# Altium schematic sheet 17_FE_PORT_17-24.SchDoc
size 594 x 420 mm; Author: Serbinov O.A.; CompanyName: ELSICOM; DrawnBy: Serbinov O.A.; Engineer: Serbinov O.A.; Organization: Elsicom; Address1: Kirova avenue, 58; Address2: Tomsk; Address3: Russia 634012; DocumentNumber: 18; SheetNumber: 18; SheetTotal: 44; ProjectName: 48_PORTS
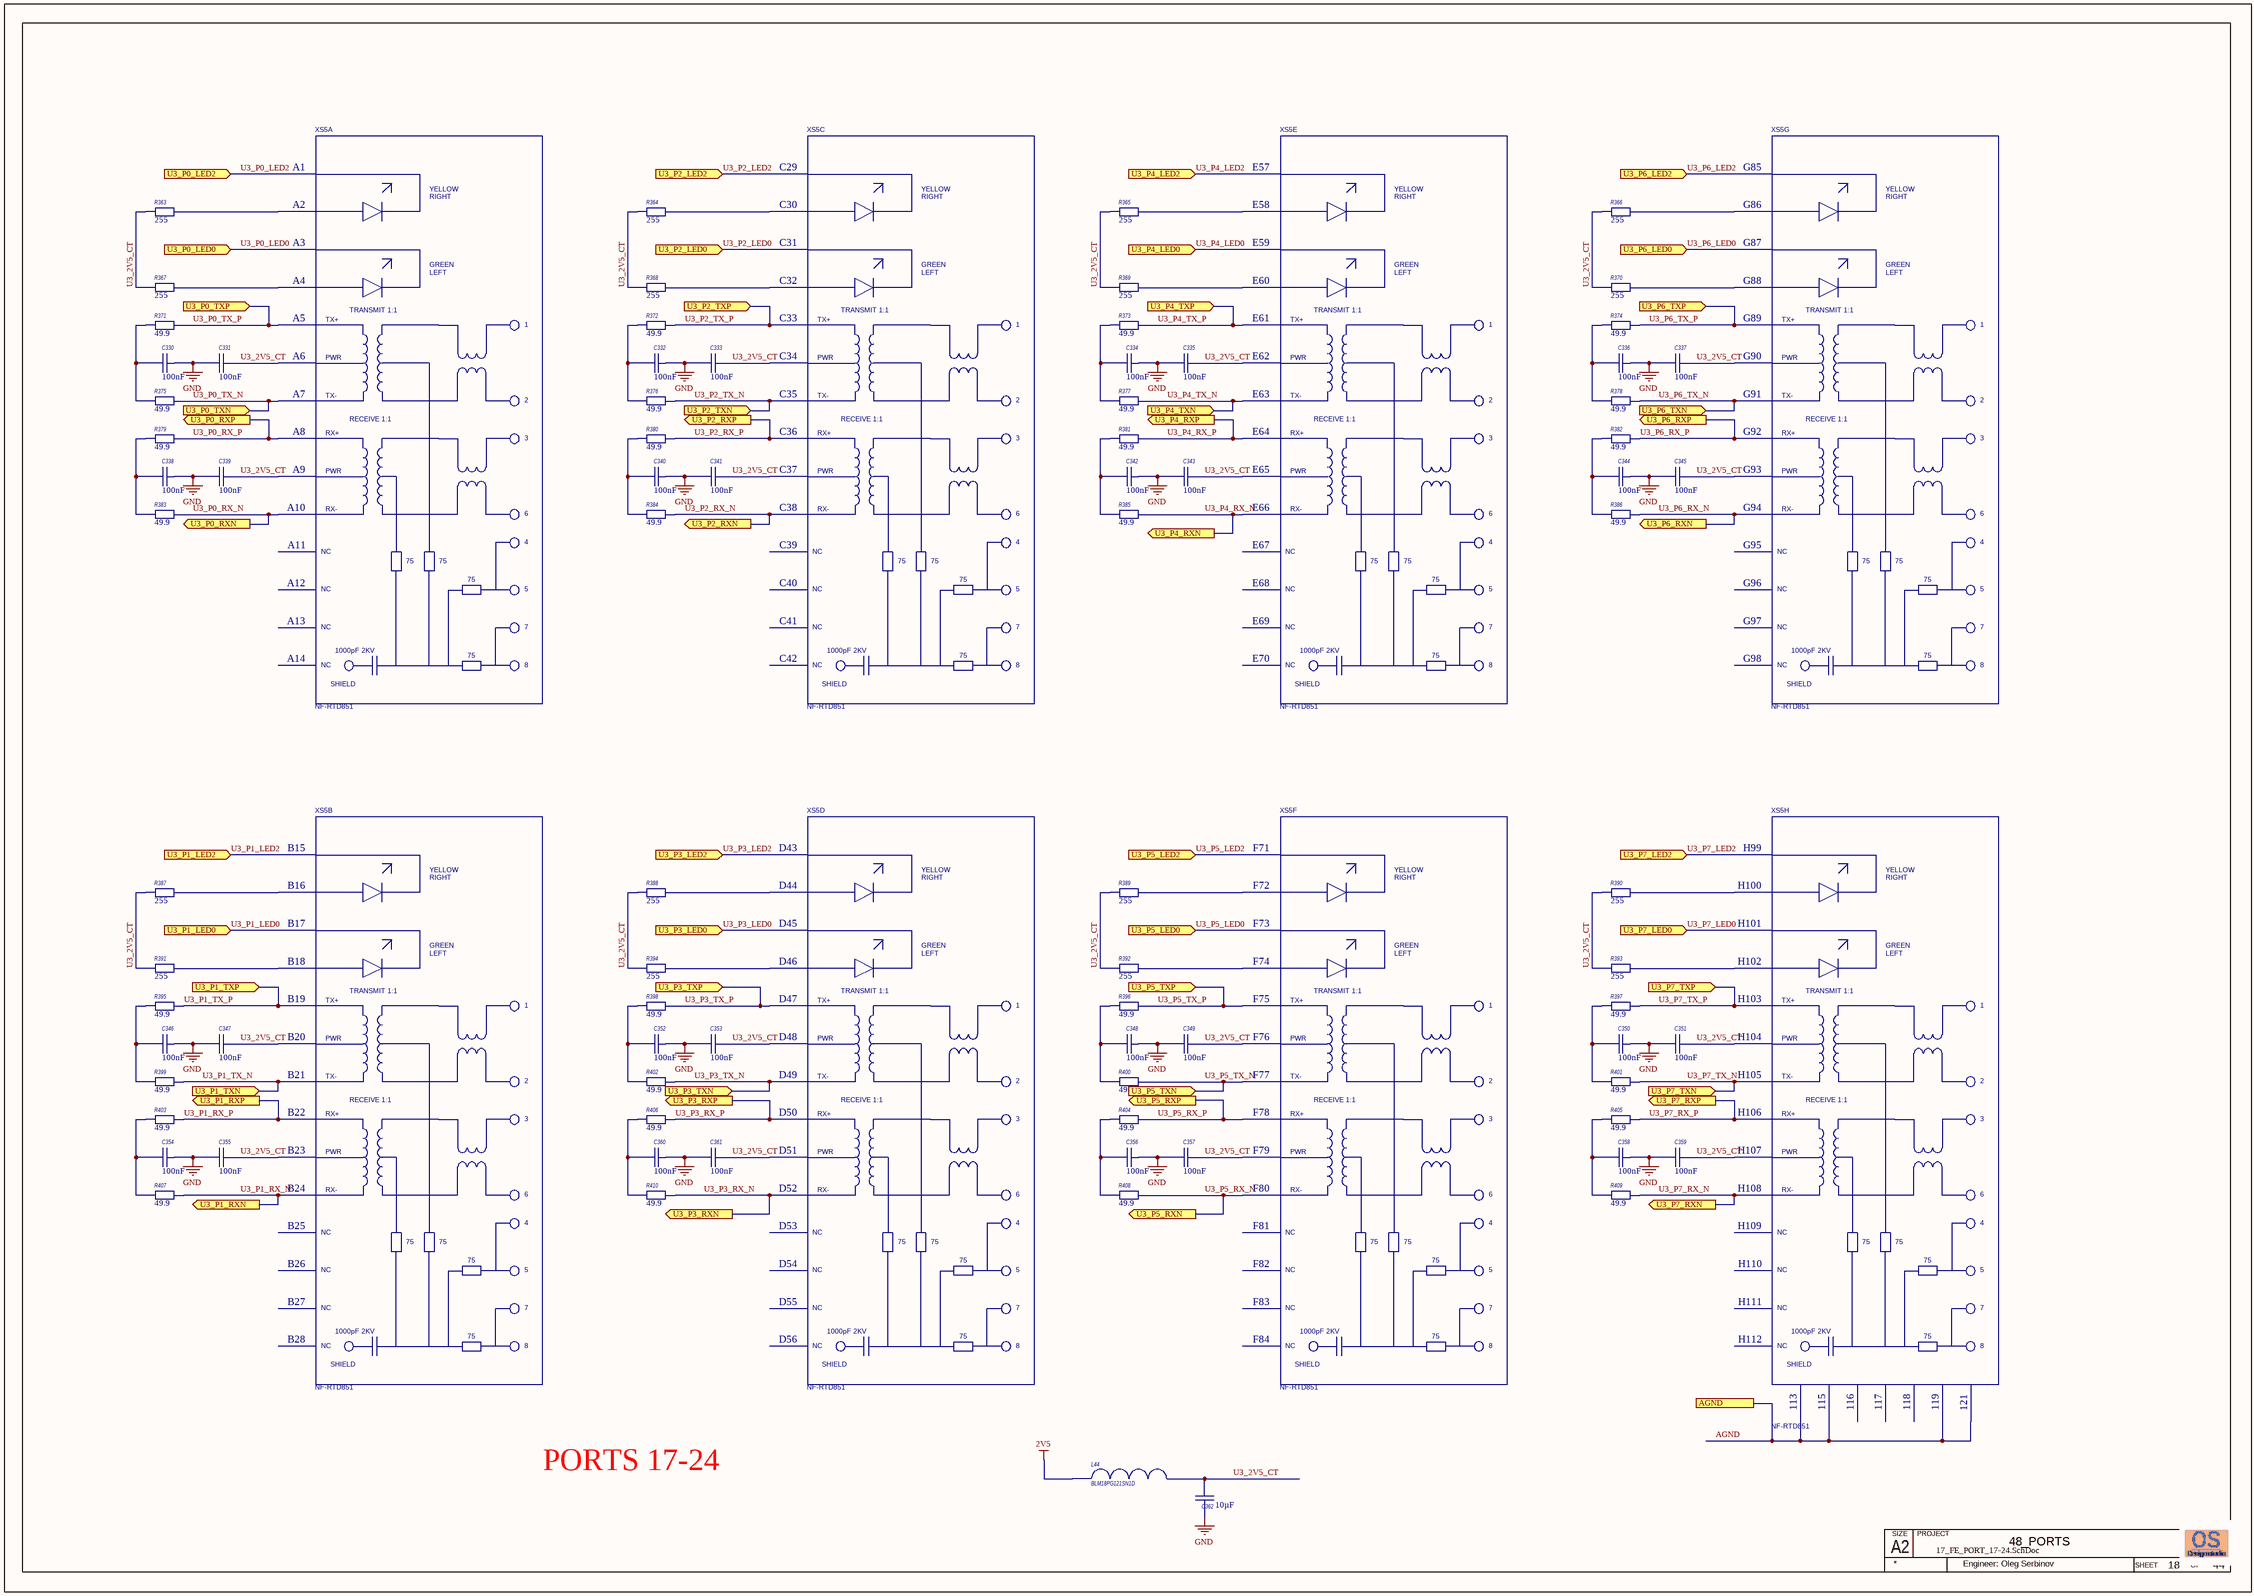
[diagram p0: 17_FE_PORT_17-24.SchDoc]

## Parts
C330  Capacitance: 100nF  [C0402_IPC High Density]  (hidden comment: GRM155R71E104KE14D)
C331  Capacitance: 100nF  [C0402_IPC High Density]  (hidden comment: GRM155R71E104KE14D)
C332  Capacitance: 100nF  [C0402_IPC High Density]  (hidden comment: GRM155R71E104KE14D)
C333  Capacitance: 100nF  [C0402_IPC High Density]  (hidden comment: GRM155R71E104KE14D)
C334  Capacitance: 100nF  [C0402_IPC High Density]  (hidden comment: GRM155R71E104KE14D)
C335  Capacitance: 100nF  [C0402_IPC High Density]  (hidden comment: GRM155R71E104KE14D)
C336  Capacitance: 100nF  [C0402_IPC High Density]  (hidden comment: GRM155R71E104KE14D)
C337  Capacitance: 100nF  [C0402_IPC High Density]  (hidden comment: GRM155R71E104KE14D)
C338  Capacitance: 100nF  [C0402_IPC High Density]  (hidden comment: GRM155R71E104KE14D)
C339  Capacitance: 100nF  [C0402_IPC High Density]  (hidden comment: GRM155R71E104KE14D)
C340  Capacitance: 100nF  [C0402_IPC High Density]  (hidden comment: GRM155R71E104KE14D)
C341  Capacitance: 100nF  [C0402_IPC High Density]  (hidden comment: GRM155R71E104KE14D)
C342  Capacitance: 100nF  [C0402_IPC High Density]  (hidden comment: GRM155R71E104KE14D)
C343  Capacitance: 100nF  [C0402_IPC High Density]  (hidden comment: GRM155R71E104KE14D)
C344  Capacitance: 100nF  [C0402_IPC High Density]  (hidden comment: GRM155R71E104KE14D)
C345  Capacitance: 100nF  [C0402_IPC High Density]  (hidden comment: GRM155R71E104KE14D)
C346  Capacitance: 100nF  [C0402_IPC High Density]  (hidden comment: GRM155R71E104KE14D)
C347  Capacitance: 100nF  [C0402_IPC High Density]  (hidden comment: GRM155R71E104KE14D)
C348  Capacitance: 100nF  [C0402_IPC High Density]  (hidden comment: GRM155R71E104KE14D)
C349  Capacitance: 100nF  [C0402_IPC High Density]  (hidden comment: GRM155R71E104KE14D)
C350  Capacitance: 100nF  [C0402_IPC High Density]  (hidden comment: GRM155R71E104KE14D)
C351  Capacitance: 100nF  [C0402_IPC High Density]  (hidden comment: GRM155R71E104KE14D)
C352  Capacitance: 100nF  [C0402_IPC High Density]  (hidden comment: GRM155R71E104KE14D)
C353  Capacitance: 100nF  [C0402_IPC High Density]  (hidden comment: GRM155R71E104KE14D)
C354  Capacitance: 100nF  [C0402_IPC High Density]  (hidden comment: GRM155R71E104KE14D)
C355  Capacitance: 100nF  [C0402_IPC High Density]  (hidden comment: GRM155R71E104KE14D)
C356  Capacitance: 100nF  [C0402_IPC High Density]  (hidden comment: GRM155R71E104KE14D)
C357  Capacitance: 100nF  [C0402_IPC High Density]  (hidden comment: GRM155R71E104KE14D)
C358  Capacitance: 100nF  [C0402_IPC High Density]  (hidden comment: GRM155R71E104KE14D)
C359  Capacitance: 100nF  [C0402_IPC High Density]  (hidden comment: GRM155R71E104KE14D)
C360  Capacitance: 100nF  [C0402_IPC High Density]  (hidden comment: GRM155R71E104KE14D)
C361  Capacitance: 100nF  [C0402_IPC High Density]  (hidden comment: GRM155R71E104KE14D)
C362  Capacitance: 10µF  [CAPC2012[0805]]  (hidden comment: GRM21BR61C106KE15)
L44  BLM18PG121SN1D  [INDC1608X95N]
R363  Resistance (Ohms): 255  [RESC1005[0402]]  (hidden comment: ERJ-2RKF2550X)
R364  Resistance (Ohms): 255  [RESC1005[0402]]  (hidden comment: ERJ-2RKF2550X)
R365  Resistance (Ohms): 255  [RESC1005[0402]]  (hidden comment: ERJ-2RKF2550X)
R366  Resistance (Ohms): 255  [RESC1005[0402]]  (hidden comment: ERJ-2RKF2550X)
R367  Resistance (Ohms): 255  [RESC1005[0402]]  (hidden comment: ERJ-2RKF2550X)
R368  Resistance (Ohms): 255  [RESC1005[0402]]  (hidden comment: ERJ-2RKF2550X)
R369  Resistance (Ohms): 255  [RESC1005[0402]]  (hidden comment: ERJ-2RKF2550X)
R370  Resistance (Ohms): 255  [RESC1005[0402]]  (hidden comment: ERJ-2RKF2550X)
R371  Resistance: 49.9  [R0402_IPC High Density]  (hidden comment: ERJ-2RKF49R9X)
R372  Resistance: 49.9  [R0402_IPC High Density]  (hidden comment: ERJ-2RKF49R9X)
R373  Resistance: 49.9  [R0402_IPC High Density]  (hidden comment: ERJ-2RKF49R9X)
R374  Resistance: 49.9  [R0402_IPC High Density]  (hidden comment: ERJ-2RKF49R9X)
R375  Resistance: 49.9  [R0402_IPC High Density]  (hidden comment: ERJ-2RKF49R9X)
R376  Resistance: 49.9  [R0402_IPC High Density]  (hidden comment: ERJ-2RKF49R9X)
R377  Resistance: 49.9  [R0402_IPC High Density]  (hidden comment: ERJ-2RKF49R9X)
R378  Resistance: 49.9  [R0402_IPC High Density]  (hidden comment: ERJ-2RKF49R9X)
R379  Resistance: 49.9  [R0402_IPC High Density]  (hidden comment: ERJ-2RKF49R9X)
R380  Resistance: 49.9  [R0402_IPC High Density]  (hidden comment: ERJ-2RKF49R9X)
R381  Resistance: 49.9  [R0402_IPC High Density]  (hidden comment: ERJ-2RKF49R9X)
R382  Resistance: 49.9  [R0402_IPC High Density]  (hidden comment: ERJ-2RKF49R9X)
R383  Resistance: 49.9  [R0402_IPC High Density]  (hidden comment: ERJ-2RKF49R9X)
R384  Resistance: 49.9  [R0402_IPC High Density]  (hidden comment: ERJ-2RKF49R9X)
R385  Resistance: 49.9  [R0402_IPC High Density]  (hidden comment: ERJ-2RKF49R9X)
R386  Resistance: 49.9  [R0402_IPC High Density]  (hidden comment: ERJ-2RKF49R9X)
R387  Resistance (Ohms): 255  [RESC1005[0402]]  (hidden comment: ERJ-2RKF2550X)
R388  Resistance (Ohms): 255  [RESC1005[0402]]  (hidden comment: ERJ-2RKF2550X)
R389  Resistance (Ohms): 255  [RESC1005[0402]]  (hidden comment: ERJ-2RKF2550X)
R390  Resistance (Ohms): 255  [RESC1005[0402]]  (hidden comment: ERJ-2RKF2550X)
R391  Resistance (Ohms): 255  [RESC1005[0402]]  (hidden comment: ERJ-2RKF2550X)
R392  Resistance (Ohms): 255  [RESC1005[0402]]  (hidden comment: ERJ-2RKF2550X)
R393  Resistance (Ohms): 255  [RESC1005[0402]]  (hidden comment: ERJ-2RKF2550X)
R394  Resistance (Ohms): 255  [RESC1005[0402]]  (hidden comment: ERJ-2RKF2550X)
R395  Resistance: 49.9  [R0402_IPC High Density]  (hidden comment: ERJ-2RKF49R9X)
R396  Resistance: 49.9  [R0402_IPC High Density]  (hidden comment: ERJ-2RKF49R9X)
R397  Resistance: 49.9  [R0402_IPC High Density]  (hidden comment: ERJ-2RKF49R9X)
R398  Resistance: 49.9  [R0402_IPC High Density]  (hidden comment: ERJ-2RKF49R9X)
R399  Resistance: 49.9  [R0402_IPC High Density]  (hidden comment: ERJ-2RKF49R9X)
R400  Resistance: 49.9  [R0402_IPC High Density]  (hidden comment: ERJ-2RKF49R9X)
R401  Resistance: 49.9  [R0402_IPC High Density]  (hidden comment: ERJ-2RKF49R9X)
R402  Resistance: 49.9  [R0402_IPC High Density]  (hidden comment: ERJ-2RKF49R9X)
R403  Resistance: 49.9  [R0402_IPC High Density]  (hidden comment: ERJ-2RKF49R9X)
R404  Resistance: 49.9  [R0402_IPC High Density]  (hidden comment: ERJ-2RKF49R9X)
R405  Resistance: 49.9  [R0402_IPC High Density]  (hidden comment: ERJ-2RKF49R9X)
R406  Resistance: 49.9  [R0402_IPC High Density]  (hidden comment: ERJ-2RKF49R9X)
R407  Resistance: 49.9  [R0402_IPC High Density]  (hidden comment: ERJ-2RKF49R9X)
R408  Resistance: 49.9  [R0402_IPC High Density]  (hidden comment: ERJ-2RKF49R9X)
R409  Resistance: 49.9  [R0402_IPC High Density]  (hidden comment: ERJ-2RKF49R9X)
R410  Resistance: 49.9  [R0402_IPC High Density]  (hidden comment: ERJ-2RKF49R9X)
XS5  NF-RTD851  [NF-RTD851_2X4_LED_NF-RTD851_2X4_LED(Primary)]  (parts A,B,C,D,E,F,G,H of 8)

## Ports
AGND, U3_P0_LED0 (in), U3_P0_LED2 (in), U3_P0_RXN (out), U3_P0_RXP (out), U3_P0_TXN (in), U3_P0_TXP (in), U3_P1_LED0 (in), U3_P1_LED2 (in), U3_P1_RXN (out), U3_P1_RXP (out), U3_P1_TXN (in), U3_P1_TXP (in), U3_P2_LED0 (in), U3_P2_LED2 (in), U3_P2_RXN (out), U3_P2_RXP (out), U3_P2_TXN (in), U3_P2_TXP (in), U3_P3_LED0 (in), U3_P3_LED2 (in), U3_P3_RXN (out), U3_P3_RXP (out), U3_P3_TXN (in), U3_P3_TXP (in), U3_P4_LED0 (in), U3_P4_LED2 (in), U3_P4_RXN (out), U3_P4_RXP (out), U3_P4_TXN (in), U3_P4_TXP (in), U3_P5_LED0 (in), U3_P5_LED2 (in), U3_P5_RXN (out), U3_P5_RXP (out), U3_P5_TXN (in), U3_P5_TXP (in), U3_P6_LED0 (in), U3_P6_LED2 (in), U3_P6_RXN (out), U3_P6_RXP (out), U3_P6_TXN (in), U3_P6_TXP (in), U3_P7_LED0 (in), U3_P7_LED2 (in), U3_P7_RXN (out), U3_P7_RXP (out), U3_P7_TXN (in), U3_P7_TXP (in)

## Nets
2V5: L44.1
GND: C330.2 C331.1 C332.2 C333.1 C334.2 C335.1 C336.2 C337.1 C338.2 C339.1 C340.2 C341.1 C342.2 C343.1 C344.2 C345.1 C346.2 C347.1 C348.2 C349.1 C350.2 C351.1 C352.2 C353.1 C354.2 C355.1 C356.2 C357.1 C358.2 C359.1 C360.2 C361.1 C362.1
AGND: XS5.113 XS5.115 XS5.119 XS5.121 ; port AGND
U3_2V5_CT: C331.2 C333.2 C335.2 C337.2 C339.2 C341.2 C343.2 C345.2 C347.2 C349.2 C351.2 C353.2 C355.2 C357.2 C359.2 C361.2 C362.2 L44.2 R363.1 R364.1 R365.1 R366.1 R367.1 R368.1 R369.1 R370.1 R387.1 R388.1 R389.1 R390.1 R391.1 R392.1 R393.1 R394.1 XS5.A6 XS5.A9 XS5.B20 XS5.B23 XS5.C34 XS5.C37 XS5.D48 XS5.D51 XS5.E62 XS5.E65 XS5.F76 XS5.F79 XS5.G90 XS5.G93 XS5.H104 XS5.H107
U3_P0_LED0: XS5.A3 ; port U3_P0_LED0
U3_P0_LED2: XS5.A1 ; port U3_P0_LED2
U3_P0_RX_N: R383.2 XS5.A10 ; port U3_P0_RXN
U3_P0_RX_P: R379.2 XS5.A8 ; port U3_P0_RXP
U3_P0_TX_N: R375.2 XS5.A7 ; port U3_P0_TXN
U3_P0_TX_P: R371.2 XS5.A5 ; port U3_P0_TXP
U3_P1_LED0: XS5.B17 ; port U3_P1_LED0
U3_P1_LED2: XS5.B15 ; port U3_P1_LED2
U3_P1_RX_N: R407.2 XS5.B24 ; port U3_P1_RXN
U3_P1_RX_P: R403.2 XS5.B22 ; port U3_P1_RXP
U3_P1_TX_N: R399.2 XS5.B21 ; port U3_P1_TXN
U3_P1_TX_P: R395.2 XS5.B19 ; port U3_P1_TXP
U3_P2_LED0: XS5.C31 ; port U3_P2_LED0
U3_P2_LED2: XS5.C29 ; port U3_P2_LED2
U3_P2_RX_N: R384.2 XS5.C38 ; port U3_P2_RXN
U3_P2_RX_P: R380.2 XS5.C36 ; port U3_P2_RXP
U3_P2_TX_N: R376.2 XS5.C35 ; port U3_P2_TXN
U3_P2_TX_P: R372.2 XS5.C33 ; port U3_P2_TXP
U3_P3_LED0: XS5.D45 ; port U3_P3_LED0
U3_P3_LED2: XS5.D43 ; port U3_P3_LED2
U3_P3_RX_N: R410.2 XS5.D52 ; port U3_P3_RXN
U3_P3_RX_P: R406.2 XS5.D50 ; port U3_P3_RXP
U3_P3_TX_N: R402.2 XS5.D49 ; port U3_P3_TXN
U3_P3_TX_P: R398.2 XS5.D47 ; port U3_P3_TXP
U3_P4_LED0: XS5.E59 ; port U3_P4_LED0
U3_P4_LED2: XS5.E57 ; port U3_P4_LED2
U3_P4_RX_N: R385.2 XS5.E66 ; port U3_P4_RXN
U3_P4_RX_P: R381.2 XS5.E64 ; port U3_P4_RXP
U3_P4_TX_N: R377.2 XS5.E63 ; port U3_P4_TXN
U3_P4_TX_P: R373.2 XS5.E61 ; port U3_P4_TXP
U3_P5_LED0: XS5.F73 ; port U3_P5_LED0
U3_P5_LED2: XS5.F71 ; port U3_P5_LED2
U3_P5_RX_N: R408.2 XS5.F80 ; port U3_P5_RXN
U3_P5_RX_P: R404.2 XS5.F78 ; port U3_P5_RXP
U3_P5_TX_N: R400.2 XS5.F77 ; port U3_P5_TXN
U3_P5_TX_P: R396.2 XS5.F75 ; port U3_P5_TXP
U3_P6_LED0: XS5.G87 ; port U3_P6_LED0
U3_P6_LED2: XS5.G85 ; port U3_P6_LED2
U3_P6_RX_N: R386.2 XS5.G94 ; port U3_P6_RXN
U3_P6_RX_P: R382.2 XS5.G92 ; port U3_P6_RXP
U3_P6_TX_N: R378.2 XS5.G91 ; port U3_P6_TXN
U3_P6_TX_P: R374.2 XS5.G89 ; port U3_P6_TXP
U3_P7_LED0: XS5.H101 ; port U3_P7_LED0
U3_P7_LED2: XS5.H99 ; port U3_P7_LED2
U3_P7_RX_N: R409.2 XS5.H108 ; port U3_P7_RXN
U3_P7_RX_P: R405.2 XS5.H106 ; port U3_P7_RXP
U3_P7_TX_N: R401.2 XS5.H105 ; port U3_P7_TXN
U3_P7_TX_P: R397.2 XS5.H103 ; port U3_P7_TXP
NetC330_1: C330.1 R371.1 R375.1
NetC332_1: C332.1 R372.1 R376.1
NetC334_1: C334.1 R373.1 R377.1
NetC336_1: C336.1 R374.1 R378.1
NetC338_1: C338.1 R379.1 R383.1
NetC340_1: C340.1 R380.1 R384.1
NetC342_1: C342.1 R381.1 R385.1
NetC344_1: C344.1 R382.1 R386.1
NetC346_1: C346.1 R395.1 R399.1
NetC348_1: C348.1 R396.1 R400.1
NetC350_1: C350.1 R397.1 R401.1
NetC352_1: C352.1 R398.1 R402.1
NetC354_1: C354.1 R403.1 R407.1
NetC356_1: C356.1 R404.1 R408.1
NetC358_1: C358.1 R405.1 R409.1
NetC360_1: C360.1 R406.1 R410.1
NetR363_2: R363.2 XS5.A2
NetR364_2: R364.2 XS5.C30
NetR365_2: R365.2 XS5.E58
NetR366_2: R366.2 XS5.G86
NetR367_2: R367.2 XS5.A4
NetR368_2: R368.2 XS5.C32
NetR369_2: R369.2 XS5.E60
NetR370_2: R370.2 XS5.G88
NetR387_2: R387.2 XS5.B16
NetR388_2: R388.2 XS5.D44
NetR389_2: R389.2 XS5.F72
NetR390_2: R390.2 XS5.H100
NetR391_2: R391.2 XS5.B18
NetR392_2: R392.2 XS5.F74
NetR393_2: R393.2 XS5.H102
NetR394_2: R394.2 XS5.D46

Not connected (* = marked no-connect by the designer): XS5 114 116 117 118 120 A11 A12 A13 A14 B25 B26 B27 B28 C39 C40 C41 C42 D53 D54 D55 D56 E67 E68 E69 E70 F81 F82 F83 F84 G95 G96 G97 G98 H109 H110 H111 H112

## Notes on the sheet
- PORTS 17-24
- A2
- SIZE
- PROJECT
- SHEET
- OF
- Engineer: Oleg Serbinov
- (in symbol NF-RTD851 2X4 EMI LED, part A) YELLOW; RIGHT; GREEN; LEFT; TRANSMIT 1:1; TX+; 1; PWR; TX-; 2; RECEIVE 1:1; RX+; 3; RX-; 6; 4; NC; 75; 5; 7; 1000pF 2KV; 8; SHIELD
- (in symbol NF-RTD851 2X4 EMI LED, part B) YELLOW; RIGHT; GREEN; LEFT; TRANSMIT 1:1; TX+; 1; PWR; TX-; 2; RECEIVE 1:1; RX+; 3; RX-; 6; 4; NC; 75; 5; 7; 1000pF 2KV; 8; SHIELD
- (in symbol NF-RTD851 2X4 EMI LED, part C) YELLOW; RIGHT; GREEN; LEFT; TRANSMIT 1:1; TX+; 1; PWR; TX-; 2; RECEIVE 1:1; RX+; 3; RX-; 6; 4; NC; 75; 5; 7; 1000pF 2KV; 8; SHIELD
- (in symbol NF-RTD851 2X4 EMI LED, part D) YELLOW; RIGHT; GREEN; LEFT; TRANSMIT 1:1; TX+; 1; PWR; TX-; 2; RECEIVE 1:1; RX+; 3; RX-; 6; 4; NC; 75; 5; 7; 1000pF 2KV; 8; SHIELD
- (in symbol NF-RTD851 2X4 EMI LED, part E) YELLOW; RIGHT; GREEN; LEFT; TRANSMIT 1:1; TX+; 1; PWR; TX-; 2; RECEIVE 1:1; RX+; 3; RX-; 6; 4; NC; 75; 5; 7; 1000pF 2KV; 8; SHIELD
- (in symbol NF-RTD851 2X4 EMI LED, part F) YELLOW; RIGHT; GREEN; LEFT; TRANSMIT 1:1; TX+; 1; PWR; TX-; 2; RECEIVE 1:1; RX+; 3; RX-; 6; 4; NC; 75; 5; 7; 1000pF 2KV; 8; SHIELD
- (in symbol NF-RTD851 2X4 EMI LED, part G) YELLOW; RIGHT; GREEN; LEFT; TRANSMIT 1:1; TX+; 1; PWR; TX-; 2; RECEIVE 1:1; RX+; 3; RX-; 6; 4; NC; 75; 5; 7; 1000pF 2KV; 8; SHIELD
- (in symbol NF-RTD851 2X4 EMI LED, part H) YELLOW; RIGHT; GREEN; LEFT; TRANSMIT 1:1; TX+; 1; PWR; TX-; 2; RECEIVE 1:1; RX+; 3; RX-; 6; 4; NC; 75; 5; 7; 1000pF 2KV; 8; SHIELD

## Library data of the parts
C330-C361 = GRM155R71E104KE14D: C0402, 100nF, 25V, X7R; Manufacturer: Murata; Rmanufacturer: Yageo  Samsung  TDK  Taiyo Yuden  Kemet; Customer Part Number: Конденсатор, 100n, 0402, 25V, X7R, 10%; Capacitance Tolerance: ± 10%; Voltage Rating: 16; Capacitor Case Style: 0402 [1005 Metric]; Capacitor Terminals: SMD; SVHC: No SVHC (19-Dec-2012); No. of Pins: 2; Reel Quantity: 10000; Tolerance +: 10%; Analogs: any suitable; Manufacturer Part Number: GRM155R71E104KE14D; RoHS: YES; Packaging: Reel; Package / Case: 0402; ComponentLink1URL: http://www.farnell.com/datasheets/4360.pdf; ComponentLink1Description: http://www.farnell.com/datasheets/4360.pdf; Pricing: 10000=0.008593, 30000=0.007991 (GBP); Supplier 1: Farnell; Supplier Part Number 1: 1118151; Stock: 3; Dielectric Characteristic: X7R; Operating Temperature Min: -55; Operating Temperature Max: 125; Operating Temperature Range: -55°C to +125; Series: GRM Hi-Cap; Terminal Type: Surface Mount (SMD, SMT); Tolerance -: 10%; Voltage Rating V DC: 16
C362 = GRM21BR61C106KE15: C0805, 10uF 10%, 16V, X5R; Manufacturer: Murata; Customer Part Number: Конденсатор, 10u, 0805, 16V, X5R, 10%; Analogs: any suitable; Applications: General Purpose; Category: Capacitors; Operating Temperature: -55°C ~ 85°C; Package / Case: 0805 (2012 Metric); Size / Dimension: 0.079" L x 0.049" W (2.00mm x 1.25mm); Temperature Coefficient: X5R; Tolerance: ±10%; ComponentLink1URL: http://search.murata.co.jp/Ceramy/image/img/PDF/ENG/GRM21BR61C106KE15.pdf; ComponentLink1Description: http://search.murata.co.jp/Ceramy/image/img/PDF/ENG/GRM21BR61C106KE15.pdf; Pricing: 1=0.3, 10=0.25, 50=0.1408, 100=0.1252, 250=0.09392, 500=0.08294, 1000=0.07356 (USD); Voltage - Rated: 16V; Manufacturer Part Number: GRM21BR61C106KE15
L44 = BLM18PG121SN1D: FILTER BLM18 (0603, 2A); Manufacturer: Murata; Rpart number: MPZ1608S121ATAH0 ; CIC10P121NC ; MPZ1608S121ATDH5 ; BLM18PG121SH1D ; 742792625; Rmanufacturer: Boruns  Samsung  TDK  Murata  Wurth Electronics; Customer Part Number: Дроссель, BLM18PG121SN1D, FERRITE BEAD 120 OHM 1LN, 0603; DC Resistance Max: 0.05; Impedance: 120; Ferrite Mounting: SMD; Inductor Type: Ferrite Bead; SVHC: No SVHC (19-Dec-2011); Ferrite Case Style: 0603 / 1608; Core Material: Ferrite; DC Current Max: 2000; Inductor Case Style: 0603; Inductance Tolerance: ± 25%; No. of Pins: 2; RoHS: YES; Operating Temperature Min: -55; Mounting Type: SMD; Operating Temperature Max: +125; Package / Case: 0603; Impedance @ 100MHz Typ: 120; Resistance: 0.05; Supplier Part Number: 1515738; Supplier: Farnell; ComponentLink1URL: http://www.farnell.com/datasheets/5148.pdf; ComponentLink1Description: http://www.farnell.com/datasheets/5148.pdf; Pricing: 5=0.056, 50=0.041, 100=0.034, 250=0.028, 500=0.027 (GBP); Manufacturer Part Number: BLM18PG121SN1D; DC Current Rating: 2A; Analogs: MPZ1608S121ATAH0 ; CIC10P121NC ; MPZ1608S121ATDH5 ; BLM18PG121SH1D ; 742792625
R363-R370 R387-R394 = ERJ-2RKF2550X: R0402, 255R 1%; Manufacturer: Panasonic; Customer Part Number: Резистор, 255R, 0402, 1%; Temperature Coefficient: ±100ppm/°C; Power (Watts): 0.1W, 1/10W; Analogs: any suitable; Category: Resistors; Supplier: Digi-Key; Supplier Part Number: P255LDKR-ND; RoHS: RoHS Compliant; Manufacturer Part Number: ERJ-2RKF2550X; Packaging: Digi-Reel®; Composition: Thick Film; Number of Terminations: 2; Height: 0.016" (0.40mm); Size / Dimension: 0.039" L x 0.020" W (1.00mm x 0.50mm); Tolerance: ±1%; Features: -; Package / Case: 0402 (1005 Metric); ComponentLink1URL: http://industrial.panasonic.com/www-cgi/jvcr13pz.cgi?E+PZ+3+AOA0002+ERJ2RKF2550X+7+WW; ComponentLink1Description: http://industrial.panasonic.com/www-cgi/jvcr13pz.cgi?E+PZ+3+AOA0002+ERJ2RKF2550X+7+WW; Pricing: 1=0.1, 50=0.0242, 100=0.0184, 250=0.01364, 500=0.01008, 1000=0.00672, 5000=0.00473 (USD)
R371-R386 R395-R410 = ERJ-2RKF49R9X: R0402, 49.9R 1%; Manufacturer: Panasonic; Rpart number: RC0402FR-0749R9L ; RC1005F49R9CS ; MCR01MRTF49R9 ; CRCW040249R9FKED ; CR0402-FX-49R9GLF; Rmanufacturer: Yageo  Samsung  Stackpole Electronics  Rohm Semiconductor  Vishay Dale; Customer Part Number: Резистор, 49R9, 0402, 1%; Temperature Coefficient: 100 PPM / C; Voltage Rating: 50 Volts; Power Rating: 100 mWatts; Analogs: any suitable; Category: Thick Film Resistors - SMD; Supplier: Mouser; Supplier Part Number: 667-ERJ-2RKF49R9X; Manufacturer Part Number: ERJ-2RKF49R9X; Product Category: .; Minimum Order Quantity: 1; Series: ERJ; Product: Thick Film Resistors SMD; RoHS - Mouser: E; Reeling: True; Packaging: Reel; Termination Style: SMD/SMT; Package / Case: 0402 (1005 metric); Standard Pack Qty: 10000; Tolerance: 1 %; Operating Temperature Range: - 55 C to + 155 C; RoHS: RoHS Compliant By Exemption; Dimensions: 0.5 mm W x 1 mm L x 0.35 mm H; ComponentLink1URL: http://industrial.panasonic.com/www-data/pdf/AOA0000/AOA0000CE2.pdf; ComponentLink1Description: http://industrial.panasonic.com/www-data/pdf/AOA0000/AOA0000CE2.pdf; Pricing: 1=0.135, 25=0.032, 100=0.024, 250=0.018, 500=0.014, 1000=0.008, 2000=0.007, 5000=0.004 (AUD)
XS5 = NF-RTD851 2X4 EMI LED: Connector RJ45 100mb 8 ports and led  NF-RTD851; Customer Part Number: Разъем, NF-RTD851, CONN MAGJACK 8PORT 100 BASE-TX; Manufacturer: Shenzhen Newfly Electronics; NF-RTD851 2X4 EMI LED: NF-RTD851 2X4 EMI LED (100mb 8 ports and led); Analogs: SC863-F4-48-4222-C12, F4-48-4222-C12, 9812G-81015-8-S3L1TC-D; Manufacturer Part Number: NF-RTD851